# Altium schematic sheet TCP_IP.SchDoc
size A3
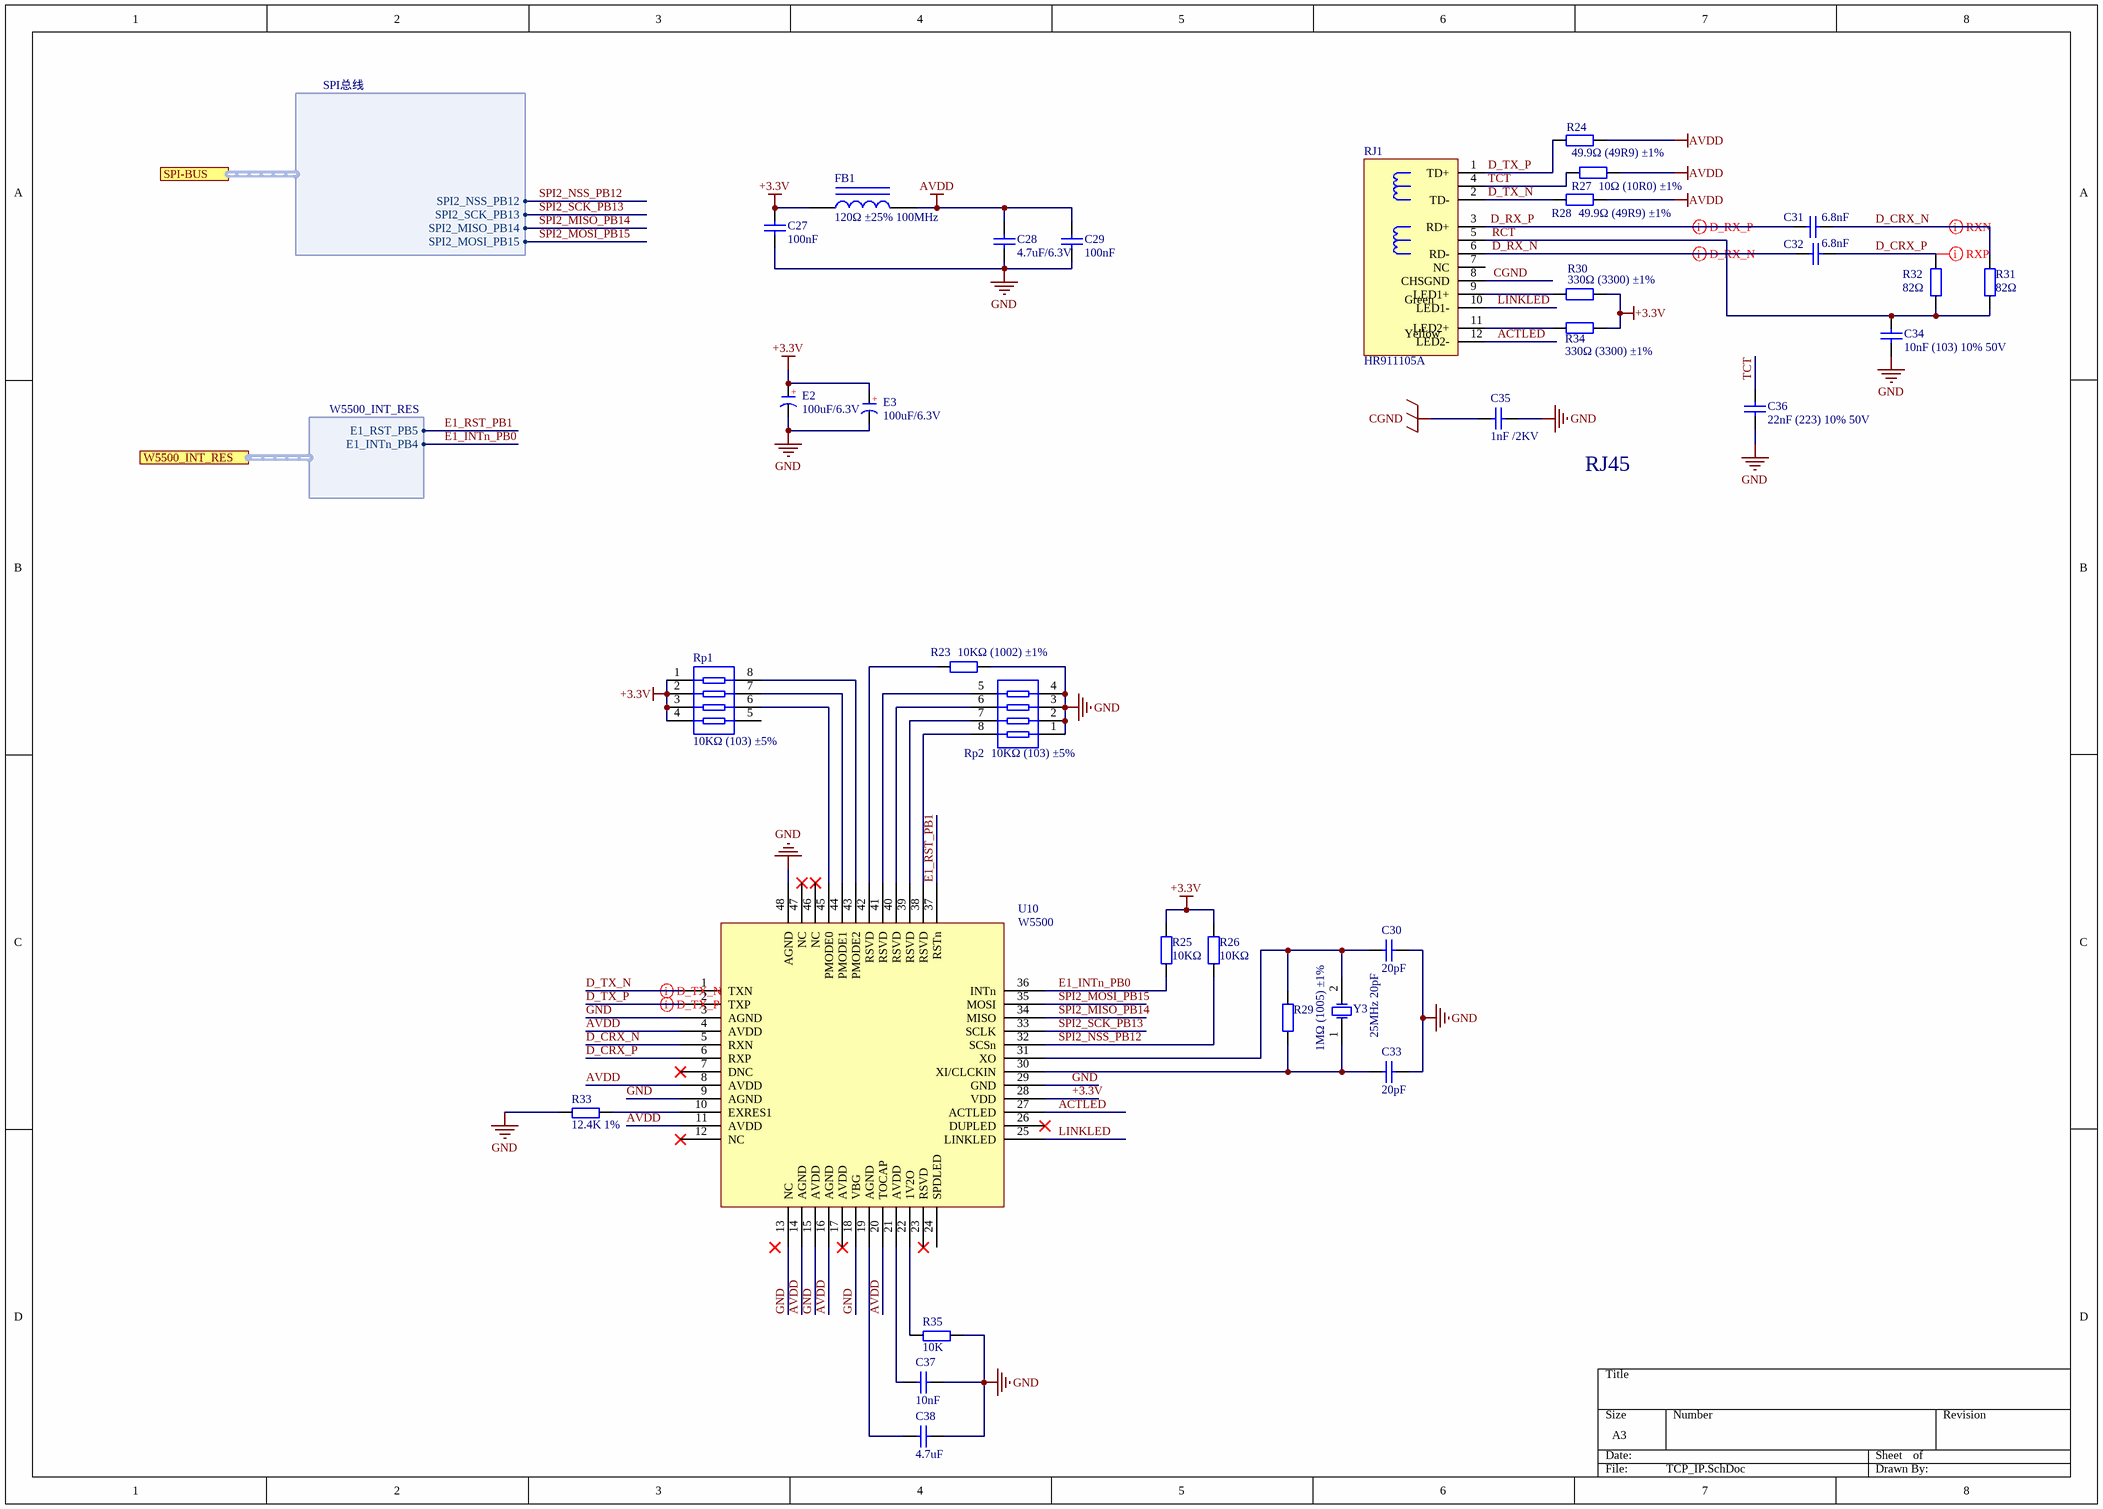
[diagram p0: TCP_IP.SchDoc]

## Parts
C27  100nF  [0603_C]
C28  4.7uF/6.3V  [0603_C]
C29  100nF  [0603_C]
C30  20pF  [0603_C]
C31  6.8nF  [0603_C]
C32  6.8nF  [0603_C]
C33  20pF  [0603_C]
C34  10nF (103) 10% 50V  [0603_C]
C35  1nF /2KV  [1206_C]
C36  22nF (223) 10% 50V  [0603_C]
C37  10nF  [0603_C]
C38  4.7uF  [0603_C]
E2  100uF/6.3V  [CM C(5*5.4)]
E3  100uF/6.3V  [CM C(5*5.4)]
FB1  120Ω ±25% 100MHz  [0805_L]
R23  10KΩ (1002) ±1%  [0603_R]
R24  49.9Ω (49R9) ±1%  [0603_R]
R25  10KΩ  [0603_R]
R26  10KΩ  [0603_R]
R27  10Ω (10R0) ±1%  [0603_R]
R28  49.9Ω (49R9) ±1%  [0603_R]
R29  1MΩ (1005) ±1%  [0603_R]
R30  330Ω (3300) ±1%  [0603_R]
R31  82Ω  [0603_R]
R32  82Ω  [0603_R]
R33  12.4K 1%  [0603_R]
R34  330Ω (3300) ±1%  [0603_R]
R35  10K  [0603_R]
RJ1  HR911105A  [RJ-45A12]
Rp1  10KΩ (103) ±5%  [0603_Rx4]
Rp2  10KΩ (103) ±5%  [0603_Rx4]
U10  W5500  [LQFP-48_7x7x05P]
Y3  25MHz 20pF  [XTAL-49S DIP]

## Ports
SPI-BUS (harness SPI总线), W5500_INT_RES (harness W5500_INT_RES)

## Harnesses
SPI总线: SPI2_NSS_PB12, SPI2_SCK_PB13, SPI2_MISO_PB14, SPI2_MOSI_PB15
W5500_INT_RES: E1_RST_PB5, E1_INTn_PB4

## Nets
+3.3V: C27.2 E2.1(A) E3.1(A) FB1.1 R25.2 R26.2 R30.1 R34.1 Rp1.1 Rp1.2 Rp1.3 Rp1.4 U10.28(VDD)
AVDD: C28.2 C29.2 FB1.2 R24.2 R27.1 R28.2 U10.4(AVDD) U10.8(AVDD) U10.11(AVDD) U10.14(AGND) U10.16(AGND) U10.20(TOCAP)
CGND: C35.1 RJ1.8(CHSGND)
GND: C27.1 C28.1 C29.1 C30.1 C33.1 C34.1 C35.2 C36.1 C37.1 C38.2 E2.2(K) E3.2(K) R23.2 R33.1 R35.2 Rp2.1 Rp2.2 Rp2.3 Rp2.4 U10.3(AGND) U10.9(AGND) U10.13(NC) U10.15(AVDD) U10.18(VBG) U10.29(GND) U10.48(AGND)
ACTLED: RJ1.12(LED2-) U10.27(ACTLED)
D_CRX_N: C31.1 R31.2 U10.5(RXN)
D_CRX_P: C32.1 R32.2 U10.6(RXP)
D_RX_N: C32.2 RJ1.6(RD-)
D_RX_P: C31.2 RJ1.3(RD+)
D_TX_N: R28.1 RJ1.2(TD-) U10.1(TXN)
D_TX_P: R24.1 RJ1.1(TD+) U10.2(TXP)
E1_INTn_PB0: R25.1 U10.36(INTn) ; port W5500_INT_RES.E1_INTn_PB4
E1_RST_PB1: U10.37(RSTn) ; port W5500_INT_RES.E1_RST_PB5
LINKLED: RJ1.10(LED1-) U10.25(LINKLED)
RCT: C34.2 R31.1 R32.1 RJ1.5
SPI2_MISO_PB14: U10.34(MISO) ; port SPI-BUS.SPI2_MISO_PB14
SPI2_MOSI_PB15: U10.35(MOSI) ; port SPI-BUS.SPI2_MOSI_PB15
SPI2_NSS_PB12: R26.1 U10.32(SCSn) ; port SPI-BUS.SPI2_NSS_PB12
SPI2_SCK_PB13: U10.33(SCLK) ; port SPI-BUS.SPI2_SCK_PB13
TCT: C36.2 R27.2 RJ1.4
NetC30_2: C30.2 R29.2 U10.31(XO) Y3.2(OSC2)
NetC33_2: C33.2 R29.1 U10.30(XI/CLCKIN) Y3.1(OSC1)
NetC37_2: C37.2 U10.21(AVDD)
NetC38_1: C38.1 U10.19(AGND)
NetR23_1: R23.1 U10.42(RSVD)
NetR30_2: R30.2 RJ1.9(LED1+)
NetR33_2: R33.2 U10.10(EXRES1)
NetR34_2: R34.2 RJ1.11(LED2+)
NetR35_1: R35.1 U10.22(1V2O)
NetRp1_6: Rp1.6 U10.45(PMODE0)
NetRp1_7: Rp1.7 U10.44(PMODE1)
NetRp1_8: Rp1.8 U10.43(PMODE2)
NetRp2_5: Rp2.5 U10.41(RSVD)
NetRp2_6: Rp2.6 U10.40(RSVD)
NetRp2_7: Rp2.7 U10.39(RSVD)
NetRp2_8: Rp2.8 U10.38(RSVD)

Not connected (* = marked no-connect by the designer): RJ1 7(NC); Rp1 5; U10 7(DNC)* 12(NC)* 17(AVDD)* 23(RSVD)* 24(SPDLED) 26(DUPLED)* 46(NC)* 47(NC)*

## Layout directives
differential pair; net class ERX: D_CRX_N, D_CRX_P, D_RX_N, D_RX_P
differential pair; net class ETX: D_TX_N, D_TX_P

## Notes on the sheet
- RJ45
- (in symbol C-CM) +
- (in symbol HR911105A) Green; Yellow

## Library data of the parts
C27-C29 = 0603 100nF (104) 10% 50V: 贴片电容; ComponentLink1Description: 供应商链接; ComponentLink1URL: http://www.szlcsc.com/product/details_15331.html; Package: 0603; Supplier: LC; SuppliersPartNumber: C14663
C30 C33 = 0603 6pF (6R0) 0.25pF 50V: 贴片电容; ComponentLink1Description: 供应商链接; ComponentLink1URL: http://www.szlcsc.com/product/details_38453.html; Package: 0603; Supplier: LC; SuppliersPartNumber: C37474
C31 C32 = 0603 6.8nF (682) 10% 50V: 贴片电容; ComponentLink1Description: 供应商链接; ComponentLink1URL: http://www.szlcsc.com/product/details_1983.html; Package: 0603; Supplier: LC; SuppliersPartNumber: C1631
C34 C37 = 0603 10nF (103) 10% 50V: 贴片电容; ComponentLink1Description: 供应商链接; ComponentLink1URL: http://www.szlcsc.com/product/details_58143.html; Package: 0603; Supplier: LC; SuppliersPartNumber: C57112
C35 = 1206 470pF (471) 10% 50V: 贴片电容; ComponentLink1Description: 供应商链接; ComponentLink1URL: http://www.szlcsc.com/product/details_2220.html; Package: 1206; Supplier: LC; SuppliersPartNumber: C1868
C36 = 0603 22nF (223) 10% 50V: 贴片电容; ComponentLink1Description: 供应商链接; ComponentLink1URL: http://www.szlcsc.com/product/details_21834.html; Package: 0603; Supplier: LC; SuppliersPartNumber: C21122
C38 = 0603 4.7uF (475) 10% 16V: 贴片电容; ComponentLink1Description: 供应商链接; ComponentLink1URL: http://www.szlcsc.com/product/details_20375.html; Package: 0603; Supplier: LC; SuppliersPartNumber: C19666
E2 E3 = C-CM: 贴片电解电容; 版权归属: 源创客; BOM名称: 贴片电解电容; 学习资源: www.ooocke.com
FB1 = 0805 600Ω 25% 100MHz: 贴片磁珠; ComponentLink1Description: 供应商链接; ComponentLink1URL: http://www.szlcsc.com/product/details_1369.html; Package: 0805; Supplier: LC; SuppliersPartNumber: C1017
R23 R25 R26 = 0603 10KΩ (1002) 1%: 贴片电阻; ComponentLink1Description: 供应商链接; ComponentLink1URL: http://www.szlcsc.com/product/details_26547.html; Package: 0603; Supplier: LC; SuppliersPartNumber: C25804
R24 R28 = 0603 49.9Ω (49R9) 1%: 贴片电阻; ComponentLink1Description: 供应商链接; ComponentLink1URL: http://www.szlcsc.com/product/details_23912.html; Package: 0603; Supplier: LC; SuppliersPartNumber: C23185
R27 = 0603 10Ω (10R0) 1%: 贴片电阻; ComponentLink1Description: 供应商链接; ComponentLink1URL: http://www.szlcsc.com/product/details_23586.html; Package: 0603; Supplier: LC; SuppliersPartNumber: C22859
R29 = 0603 10MΩ (1005) 1%: 贴片电阻; ComponentLink1Description: 供应商链接; ComponentLink1URL: http://www.szlcsc.com/product/details_7726.html; Package: 0603; Supplier: LC; SuppliersPartNumber: C7250
R30 R34 = 0603 330Ω (3300) 1%: 贴片电阻; ComponentLink1Description: 供应商链接; ComponentLink1URL: http://www.szlcsc.com/product/details_23865.html; Package: 0603; Supplier: LC; SuppliersPartNumber: C23138
R31 R32 = 0603 82Ω (82R0) 1%: 贴片电阻; ComponentLink1Description: 供应商链接; ComponentLink1URL: http://www.szlcsc.com/product/details_23982.html; Package: 0603; Supplier: LC; SuppliersPartNumber: C23255
R33 R35 = R
RJ1 = HR911105A: 带灯以太网接口; 版权归属: 源创客; BOM名称: 带灯以太网接口; 学习资源: www.ooocke.com
Rp1 Rp2 = 0603*4  10KΩ (103) 5%: 贴片排阻; ComponentLink1Description: 供应商链接; ComponentLink1URL: http://www.szlcsc.com/product/details_30472.html; Package: 0603*4; Supplier: LC; SuppliersPartNumber: C29718
U10 = W5500: 以太网; ComponentLink1Description: 供应商链接; ComponentLink1URL: http://www.szlcsc.com/product/details_33808.html; Package: LQFP-48_7x7x05P; Supplier: LC; SuppliersPartNumber: C32843
Y3 = SMD-5032_2P 8MHz 20ppm 20pF: 贴片晶振; ComponentLink1Description: 供应商链接; ComponentLink1URL: http://www.szlcsc.com/product/details_19261.html; Package: SMD-5032_2P; Supplier: LC; SuppliersPartNumber: C18560